# EasyEDA Pro project DCDC.eprj, schematic FSBB_隔离电源
Board Name: Board1; Create Date: 2025-06-07; Page Name: P1; Project Name: DCDC; Schematic Name: Schematic1; Update Date: 2025-06-19; Company: 嘉立创EDA; Page Size: A4; Version: V1.0
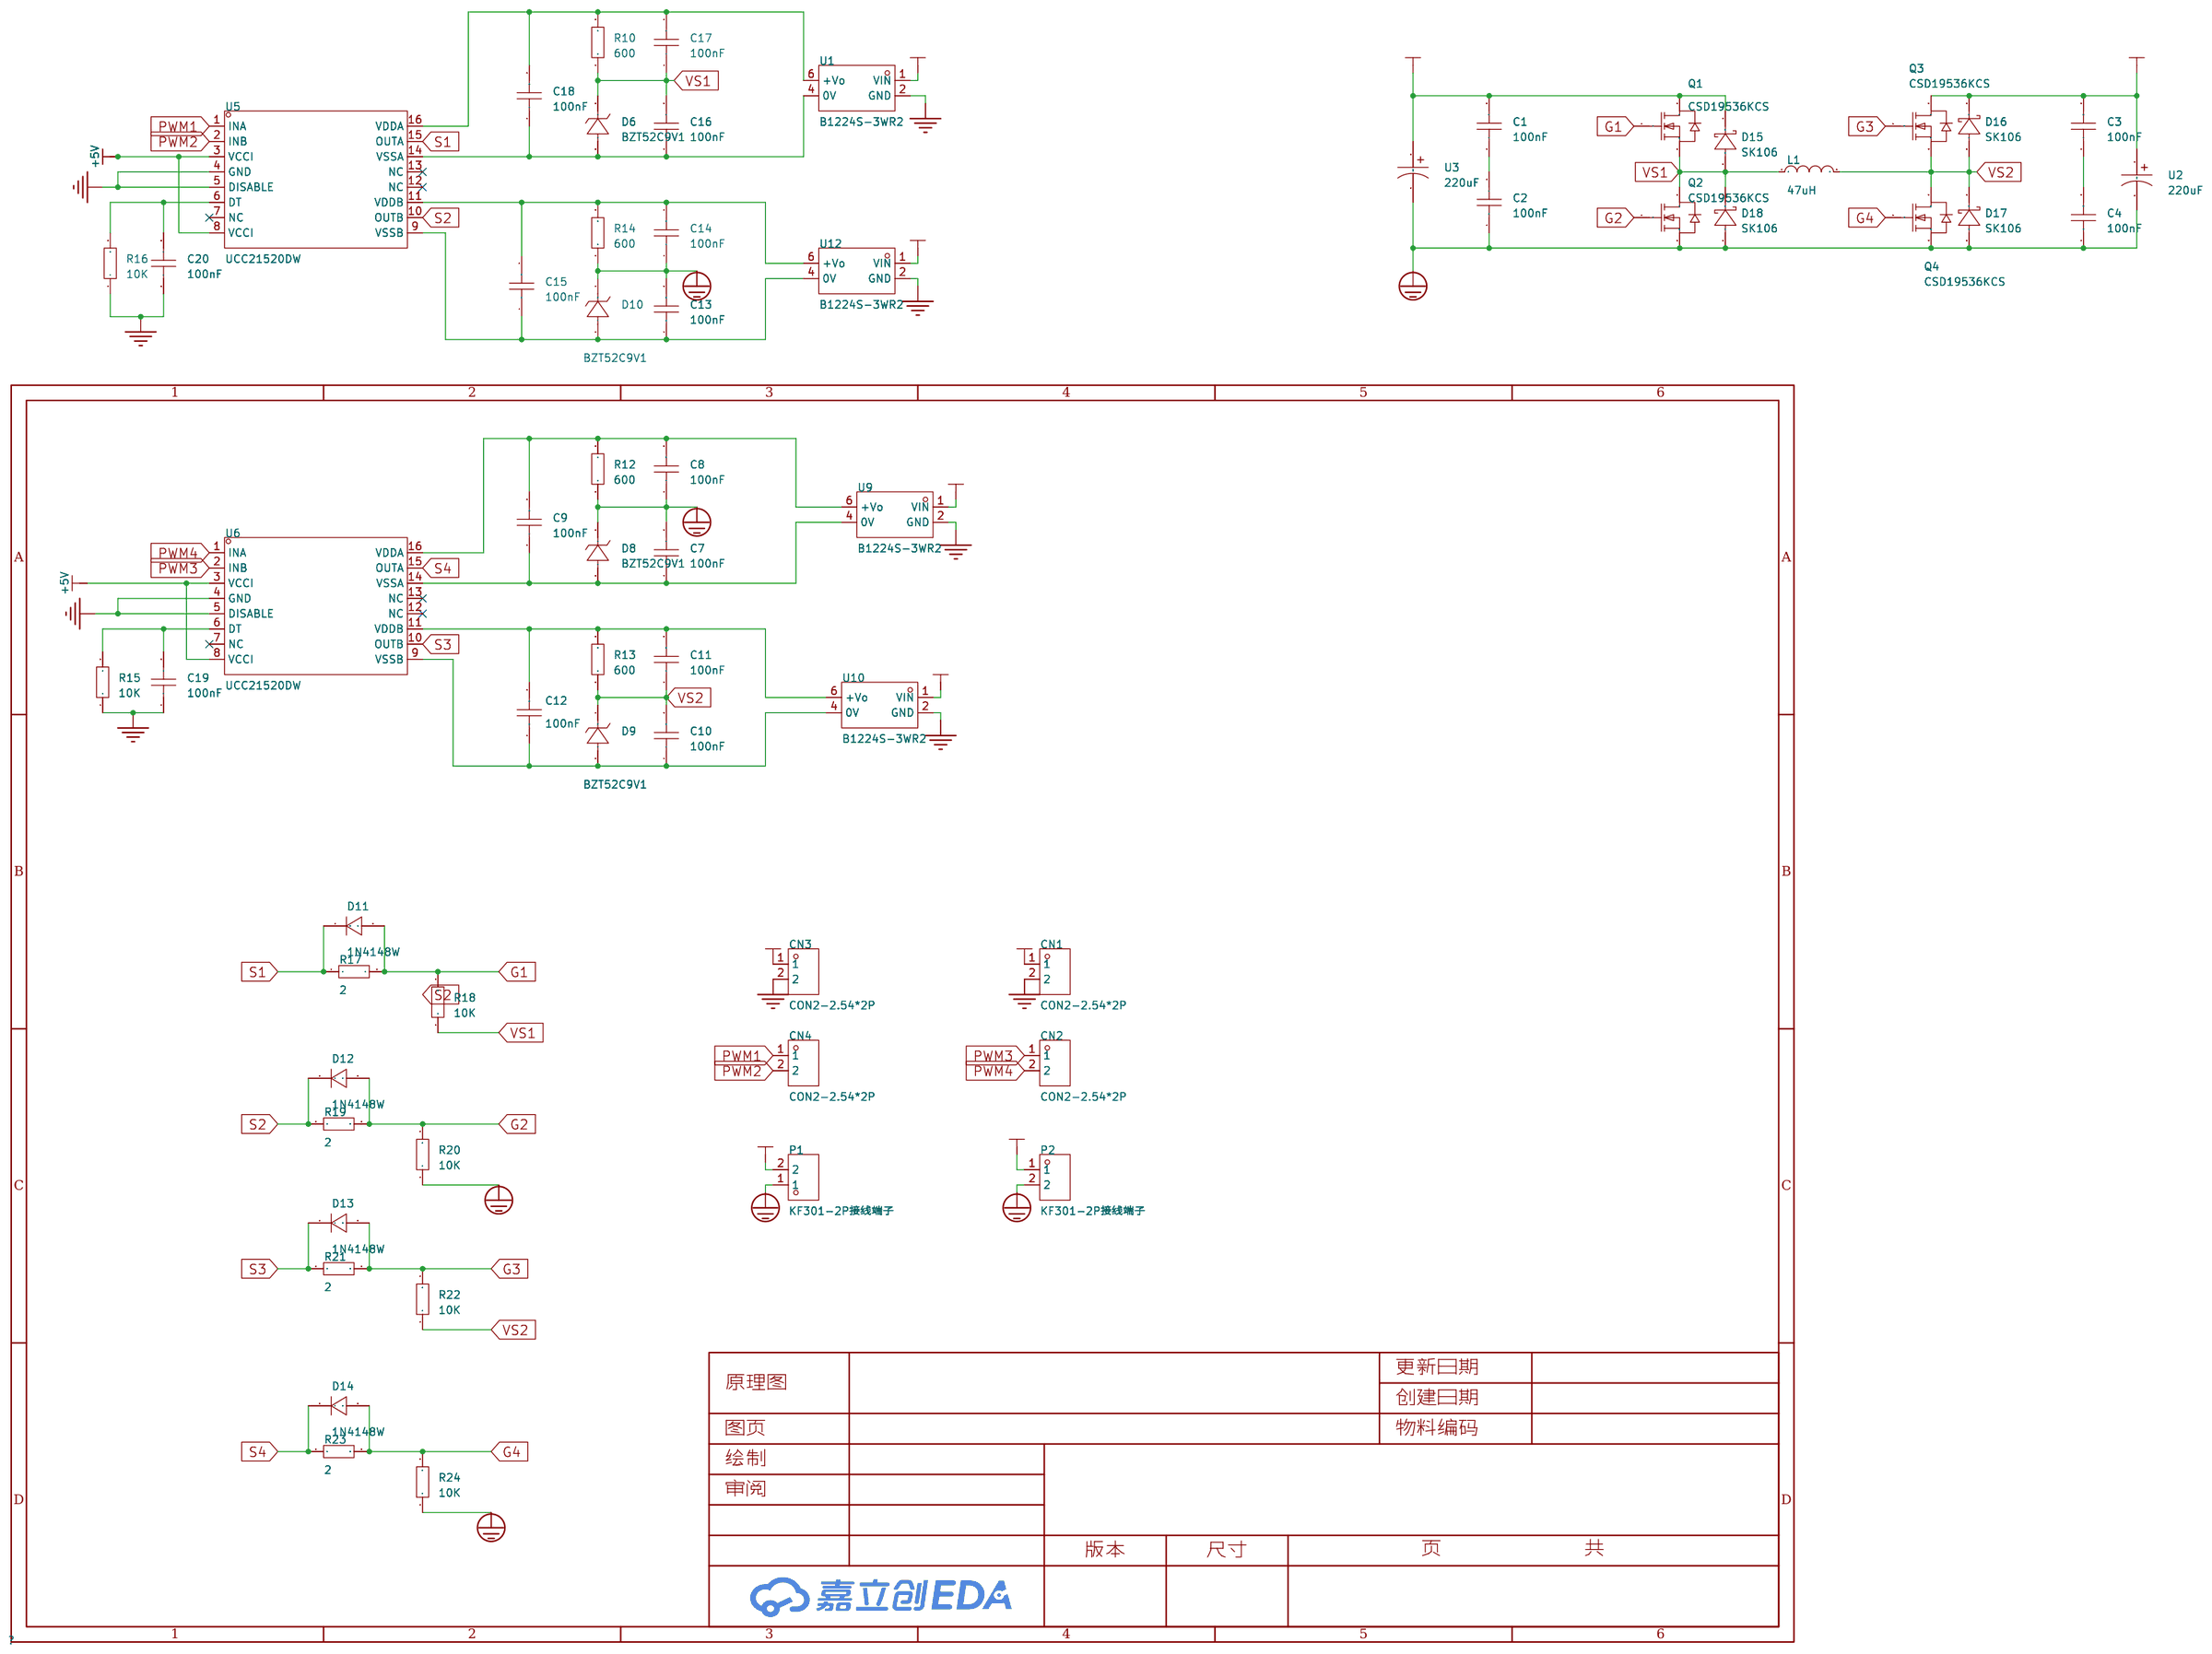
[diagram p0: schematic sheet]

## Parts
C1  100nF  [C0805]
C2  100nF  [C0805]
C3  100nF  [C0805]
C4  100nF  [C0805]
C7  100nF  [C0805]
C8  100nF  [C0805]
C9  100nF  [C0805]
C10  100nF  [C0805]
C11  100nF  [C0805]
C12  100nF  [C0805]
C13  100nF  [C0805]
C14  100nF  [C0805]
C15  100nF  [C0805]
C16  100nF  [C0805]
C17  100nF  [C0805]
C18  100nF  [C0805]
C19  100nF  [C0805]
C20  100nF  [C0805]
CN1  CON2-2.54*2P  [CONN-TH_2P-P2.54-V]
CN2  CON2-2.54*2P  [CONN-TH_2P-P2.54-V]
CN3  CON2-2.54*2P  [CONN-TH_2P-P2.54-V]
CN4  CON2-2.54*2P  [CONN-TH_2P-P2.54-V]
D6  BZT52C9V1  [SOD-123_L2.7-W1.6-LS3.7-RD-A]
D8  BZT52C9V1  [SOD-123_L2.7-W1.6-LS3.7-RD-A]
D9  BZT52C9V1  [SOD-123_L2.7-W1.6-LS3.7-RD-A]
D10  BZT52C9V1  [SOD-123_L2.7-W1.6-LS3.7-RD-A]
D11  1N4148W  [SOD-123F_L2.7-W1.6-LS3.8-RD]
D12  1N4148W  [SOD-123F_L2.7-W1.6-LS3.8-RD]
D13  1N4148W  [SOD-123F_L2.7-W1.6-LS3.8-RD]
D14  1N4148W  [SOD-123F_L2.7-W1.6-LS3.8-RD]
D15  SK106  [SMC_L6.9-W5.9-LS7.9-RD]
D16  SK106  [SMC_L6.9-W5.9-LS7.9-RD]
D17  SK106  [SMC_L6.9-W5.9-LS7.9-RD]
D18  SK106  [SMC_L6.9-W5.9-LS7.9-RD]
L1  47uH  [IND-TH_L33.0-W16.0-P17.00-D1.5]
P1  KF301-2P接线端子  [CONN-TH_XY301V-A-5.0-2P]
P2  KF301-2P接线端子  [CONN-TH_XY301V-A-5.0-2P]
Q1  CSD19536KCS  [TO-220-3_L10.0-W4.5-P2.54-L]
Q2  CSD19536KCS  [TO-220-3_L10.0-W4.5-P2.54-L]
Q3  CSD19536KCS  [TO-220-3_L10.0-W4.5-P2.54-L]
Q4  CSD19536KCS  [TO-220-3_L10.0-W4.5-P2.54-L]
R10  600  [R0805]
R12  600  [R0805]
R13  600  [R0805]
R14  600  [R0805]
R15  10K  [R0805]
R16  10K  [R0805]
R17  2  [R0805]
R18  10K  [R0805]
R19  2  [R0805]
R20  10K  [R0805]
R21  2  [R0805]
R22  10K  [R0805]
R23  2  [R0805]
R24  10K  [R0805]
U1  B1224S-3WR2  [PWRM-TH_YLPTEC_BXXXXS-3WR2]
U2  220uF  [CAP-TH_BD22.0-P10.00-D1.4-FD]
U3  220uF  [CAP-TH_BD22.0-P10.00-D1.4-FD]
U5  UCC21520DW  [SOIC-16_L10.3-W7.5-P1.27-LS10.3-BL]
U6  UCC21520DW  [SOIC-16_L10.3-W7.5-P1.27-LS10.3-BL]
U9  B1224S-3WR2  [PWRM-TH_YLPTEC_BXXXXS-3WR2]
U10  B1224S-3WR2  [PWRM-TH_YLPTEC_BXXXXS-3WR2]
U12  B1224S-3WR2  [PWRM-TH_YLPTEC_BXXXXS-3WR2]

## Library data of the parts
C1-C4 C19 C20 = CAP_0805: Supplier Footprint: 0805
C7-C18 = CAP_0603: Supplier Footprint: 0603
CN1-CN4 = CON2-2.54*2P: Supplier Part: C9900003238; Supplier Footprint: TH-2P; JLCPCB Part Class: Extended Part; Supplier: LCSC
D6 D8-D10 = BZT52C9V1: 二极管配置:独立式;稳压值(标称值):9.1V;稳压值(范围):8.5V~9.6V;耗散功率(Pd):500mW;; Supplier Part: C707139; Manufacturer: Slkor(萨科微); Supplier Footprint: SOD-123; Datasheet: https://atta.szlcsc.com/upload/public/pdf/source/20200721/C707125_BAEA70ACC1B0F60BBAC1FD71D8806D24.pdf; Supplier: LCSC; Diode Configuration: 独立式; Zener Voltage(Nom): 9.1V; Reverse Leakage Current (Ir): 500nA@6V; Zener Voltage(Range): 8.5V~9.6V; Pd - Power Dissipation: 500mW; Impedance(Zzt): 15Ω
D11-D14 = 1N4148W_C81598: LCSC Part Name: 电压:75V 电流:150mA; Supplier Part: C81598; Manufacturer: ST(先科); Supplier Footprint: SOD-123; JLCPCB Part Class: Basic Part; Datasheet: https://atta.szlcsc.com/upload/public/pdf/source/20161024/1477288446905.pdf; Supplier: LCSC; Diode Configuration: 独立式; Forward Voltage (Vf@If): 1V@50mA; Reverse Voltage (Vr): 75V; Average Rectified Current (Io): 150mA; Power Dissipation: 400mW; Reverse Leakage Current: 1uA@75V; Reverse Recovery Time (trr): 4ns
D15-D18 = SK106: LCSC Part Name: 电压:60V 电流:10A; Supplier Part: C5295552; Manufacturer: CJ(江苏长电/长晶); Supplier Footprint: SMCG; JLCPCB Part Class: 扩展库; Datasheet: https://atta.szlcsc.com/upload/public/pdf/source/20220712/6453B9A563D0FBA951B064AEABAD301D.pdf; Supplier: LCSC; Voltage - DC Reverse(Vr): 60V; Current - Rectified: 10A
L1 = XR106125TS470MV1L: LCSC Part Name: 带热缩套管; Supplier Part: C22358528; Manufacturer: XR(祥如); Supplier Footprint: 插件,33x15.6mm; JLCPCB Part Class: 扩展库; Datasheet: https://atta.szlcsc.com/upload/public/pdf/source/20240313/3B46D856669B9C4B865D9288641DA483.pdf; Supplier: LCSC; Tolerance: ±10%; Current Rating: 5A; Type: 磁环电感; Wire Diameter: 1mm
P1 P2 = KF301-2P接线端子: Supplier Part: C9900016950; Supplier Footprint: CK301-2P; JLCPCB Part Class: Extended Part; Supplier: LCSC
Q1-Q4 = CSD19536KCS: LCSC Part Name: 1个N沟道 耐压:100V 电流:150A; Supplier Part: C206030; Manufacturer: TI(德州仪器); Supplier Footprint: TO-220; JLCPCB Part Class: 扩展库; Datasheet: https://www.ti.com/cn/lit/gpn/csd19536kcs; Supplier: LCSC; Type: 1个N沟道; Drain Source Voltage (Vdss): 100V; Continuous Drain Current (Id): 150A; Power Dissipation (Pd): 375W; Drain Source On Resistance (RDS(on)@Vgs,Id): 2.7mΩ@10V,100A; Gate Threshold Voltage (Vgs(th)@Id): 3.2V@250uA; Total Gate Charge (Qg@Vgs): 153nC@10V; Input Capacitance (Ciss@Vds): 12nF@50V; Operating Temperature: -55℃~+175℃@(Tj)
R10 R12-R24 = Res_0805: Supplier Footprint: 0805
U1 U9 U10 U12 = B1224S-3WR2: B1224S-3WR2品是专门应用在分布式电源系统中需要产生一路与输入电源隔离的电源的应用场合而设计。该产品适用于：纯数字电路，一般低频模拟电路，继电器驱动电路，数据交换电路等输出电压15V，输出电流（mA）200，可持续 短路保护空载输入电流低至4mA效率高达85%低纹波系数和低噪音隔离电压 1500VDC国际标准引脚方式工作温度范围：-40℃ ~+105℃可根据客户需求设计特殊规格产品●; Supplier Part: C5369508; Manufacturer: YLPTEC(易川); Supplier Footprint: SIP-4; JLCPCB Part Class: 扩展库; Supplier: LCSC; TYPE: 升压型; Number of channel: 1; Power: 3W; input voltage (Vdc): 10.8V~13.2V; Conversion Efficiency: 88%; Output Voltage: 24V; Output Current (Max): 125mA; Maximum Capacitive Load: 220uF; Insulated Voltage: 1500V; Protective function: 短路保护
U2 U3 = ERH2WM221O46OT: LCSC Part Name: 220uF ±20% 450V; Supplier Part: C2937537; Manufacturer: AISHI(艾华集团); Supplier Footprint: 插件,D22xL46mm; JLCPCB Part Class: 扩展库; Datasheet: https://atta.szlcsc.com/upload/public/pdf/source/20211228/8DC8D1CED5B28B034FFD0D50EADAC965.pdf; Supplier: LCSC; Tolerance: ±20%; Rated Voltage: 450V; φD: 22mm; L: 46mm; Lifetime @ Temp: 3000hrs@105℃; Operating Temperature: -40℃~+105℃
U5 U6 = UCC21520DW: UCC21520 4A/6A、5.7 kVrms 双通道隔离式栅极驱动器; Supplier Part: C200361; Manufacturer: TI(德州仪器); Supplier Footprint: SOIC-16-300mil; JLCPCB Part Class: 扩展库; Datasheet: https://www.ti.com/cn/lit/gpn/ucc21520; Supplier: LCSC

## Nets
+5V: CN1.1 U5.3(VCCI) U5.8(VCCI) U6.3(VCCI) U6.8(VCCI)
+12V: CN3.1 U1.1(VIN) U9.1(VIN) U10.1(VIN) U12.1(VIN)
GND: C19.1 C20.1 CN1.2 CN3.2 R15.1 R16.1 U1.2(GND) U5.4(GND) U5.5(DISABLE) U6.4(GND) U6.5(DISABLE) U9.2(GND) U10.2(GND) U12.2(GND)
PGND: C2.1 C4.1 C7.2 C8.1 C13.2 C14.1 D8.1(K) D10.1(K) D17.2(A) D18.2(A) P1.1 P2.2 Q2.3(S) Q4.3(S) R12.1 R14.1 R20.1 R24.1 U2.2 U3.2
G1: D11.2(A) Q1.1(G) R17.2 R18.2
G2: D12.2(A) Q2.1(G) R19.2 R20.2
G3: D13.2(A) Q3.1(G) R21.2 R22.2
G4: D14.2(A) Q4.1(G) R23.2 R24.2
PWM1: CN4.1 U5.1(INA)
PWM2: CN4.2 U5.2(INB)
PWM3: CN2.1 U6.2(INB)
PWM4: CN2.2 U6.1(INA)
S1: D11.1(K) R17.1 U5.15(OUTA)
S2: D12.1(K) R19.1 U5.10(OUTB)
S3: D13.1(K) R21.1 U6.10(OUTB)
S4: D14.1(K) R23.1 U6.15(OUTA)
VDC: C1.2 D15.1(C) P1.2 Q1.2(D) U3.1
VOUT: C3.2 D16.1(C) P2.1 Q3.2(D) U2.1
VS1: C16.2 C17.1 D6.1(K) D15.2(A) D18.1(C) L1.1 Q1.3(S) Q2.2(D) R10.1 R18.1
VS2: C10.2 C11.1 D9.1(K) D16.2(A) D17.1(C) L1.2 Q3.3(S) Q4.2(D) R13.1 R22.1
$1N1312: C1.1 C2.2
$1N1346: C3.1 C4.2
$1N2910: C16.1 C18.1 D6.2(A) U1.4(0V) U5.14(VSSA)
$1N2914: C7.1 C9.1 D8.2(A) U6.14(VSSA) U9.4(0V)
$1N2919: C11.2 C12.2 R13.2 U6.11(VDDB) U10.6(+Vo)
$1N2920: C10.1 C12.1 D9.2(A) U6.9(VSSB) U10.4(0V)
$1N2926: C13.1 C15.1 D10.2(A) U5.9(VSSB) U12.4(0V)
$1N2976: C14.2 C15.2 R14.2 U5.11(VDDB) U12.6(+Vo)
$1N2985: C17.2 C18.2 R10.2 U1.6(+Vo) U5.16(VDDA)
$1N4042: C8.2 C9.2 R12.2 U6.16(VDDA) U9.6(+Vo)
$1N4259: C20.2 R16.2 U5.6(DT)
$1N4305: C19.2 R15.2 U6.6(DT)

Not connected (* = marked no-connect by the designer): U5 7(NC)* 12(NC)* 13(NC)*; U6 7(NC)* 12(NC)* 13(NC)*
